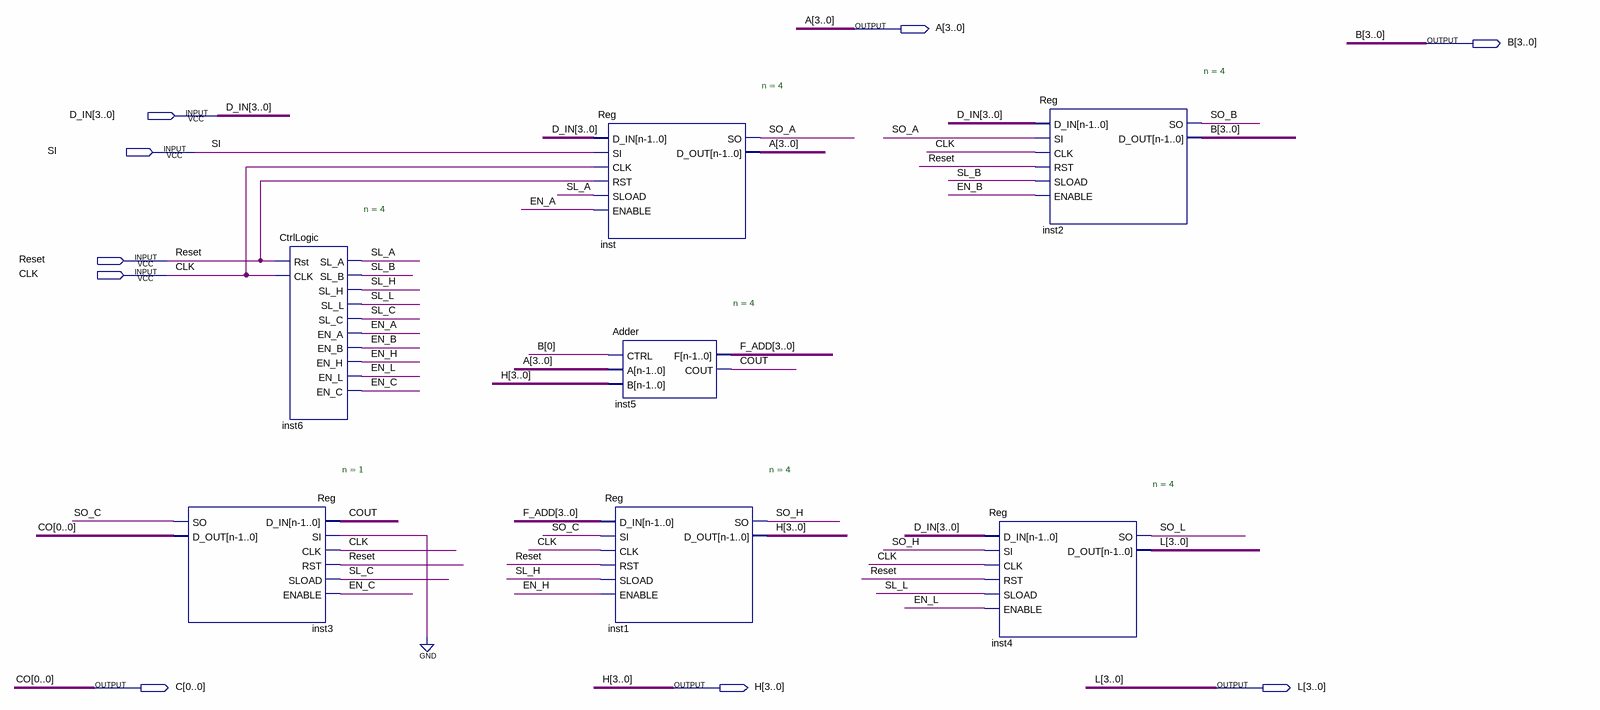
[diagram p0: schematic sheet]
// Quartus schematic MULT.bdf as structural Verilog: 7 symbols, 9 pins
module MULT (
  input  [3:0] D_IN,
  input  SI,
  input  Reset,
  input  CLK,
  output [3:0] A,
  output [3:0] B,
  output [0:0] C,
  output [3:0] H,
  output [3:0] L
);

  wire COUT, EN_A, EN_B, EN_C, EN_H, EN_L, SL_A, SL_B, SL_C, SL_H, SL_L, SO_A, SO_B, SO_C, SO_H, SO_L;
  wire [3:0] F_ADD;

  Reg #(.n(1)) inst3 (
    .D_IN(COUT), .SI(1'b0), .CLK(CLK), .RST(Reset), .SLOAD(SL_C), .ENABLE(EN_C), .SO(SO_C), .D_OUT(C[0]));
  CtrlLogic #(.n(4)) inst6 (
    .Rst(Reset), .CLK(CLK), .SL_A(SL_A), .SL_B(SL_B), .SL_H(SL_H), .SL_L(SL_L), .SL_C(SL_C), .EN_A(EN_A),
    .EN_B(EN_B), .EN_H(EN_H), .EN_L(EN_L), .EN_C(EN_C));
  Reg #(.n(4)) inst (.D_IN(D_IN), .SI(SI), .CLK(CLK), .RST(Reset), .SLOAD(SL_A), .ENABLE(EN_A), .SO(SO_A), .D_OUT(A));
  Adder #(.n(4)) inst5 (.CTRL(B[0]), .A(A), .B(H), .F(F_ADD), .COUT(COUT));
  Reg #(.n(4)) inst1 (
    .D_IN(F_ADD), .SI(SO_C), .CLK(CLK), .RST(Reset), .SLOAD(SL_H), .ENABLE(EN_H), .SO(SO_H), .D_OUT(H));
  Reg #(.n(4)) inst4 (
    .D_IN(D_IN), .SI(SO_H), .CLK(CLK), .RST(Reset), .SLOAD(SL_L), .ENABLE(EN_L), .SO(SO_L), .D_OUT(L));
  Reg #(.n(4)) inst2 (
    .D_IN(D_IN), .SI(SO_A), .CLK(CLK), .RST(Reset), .SLOAD(SL_B), .ENABLE(EN_B), .SO(SO_B), .D_OUT(B));

  // Other names for the same wires on the sheet: CO[0] = C[0]
endmodule
